# Altium schematic sheet Kinen Expansion.SchDoc
size B
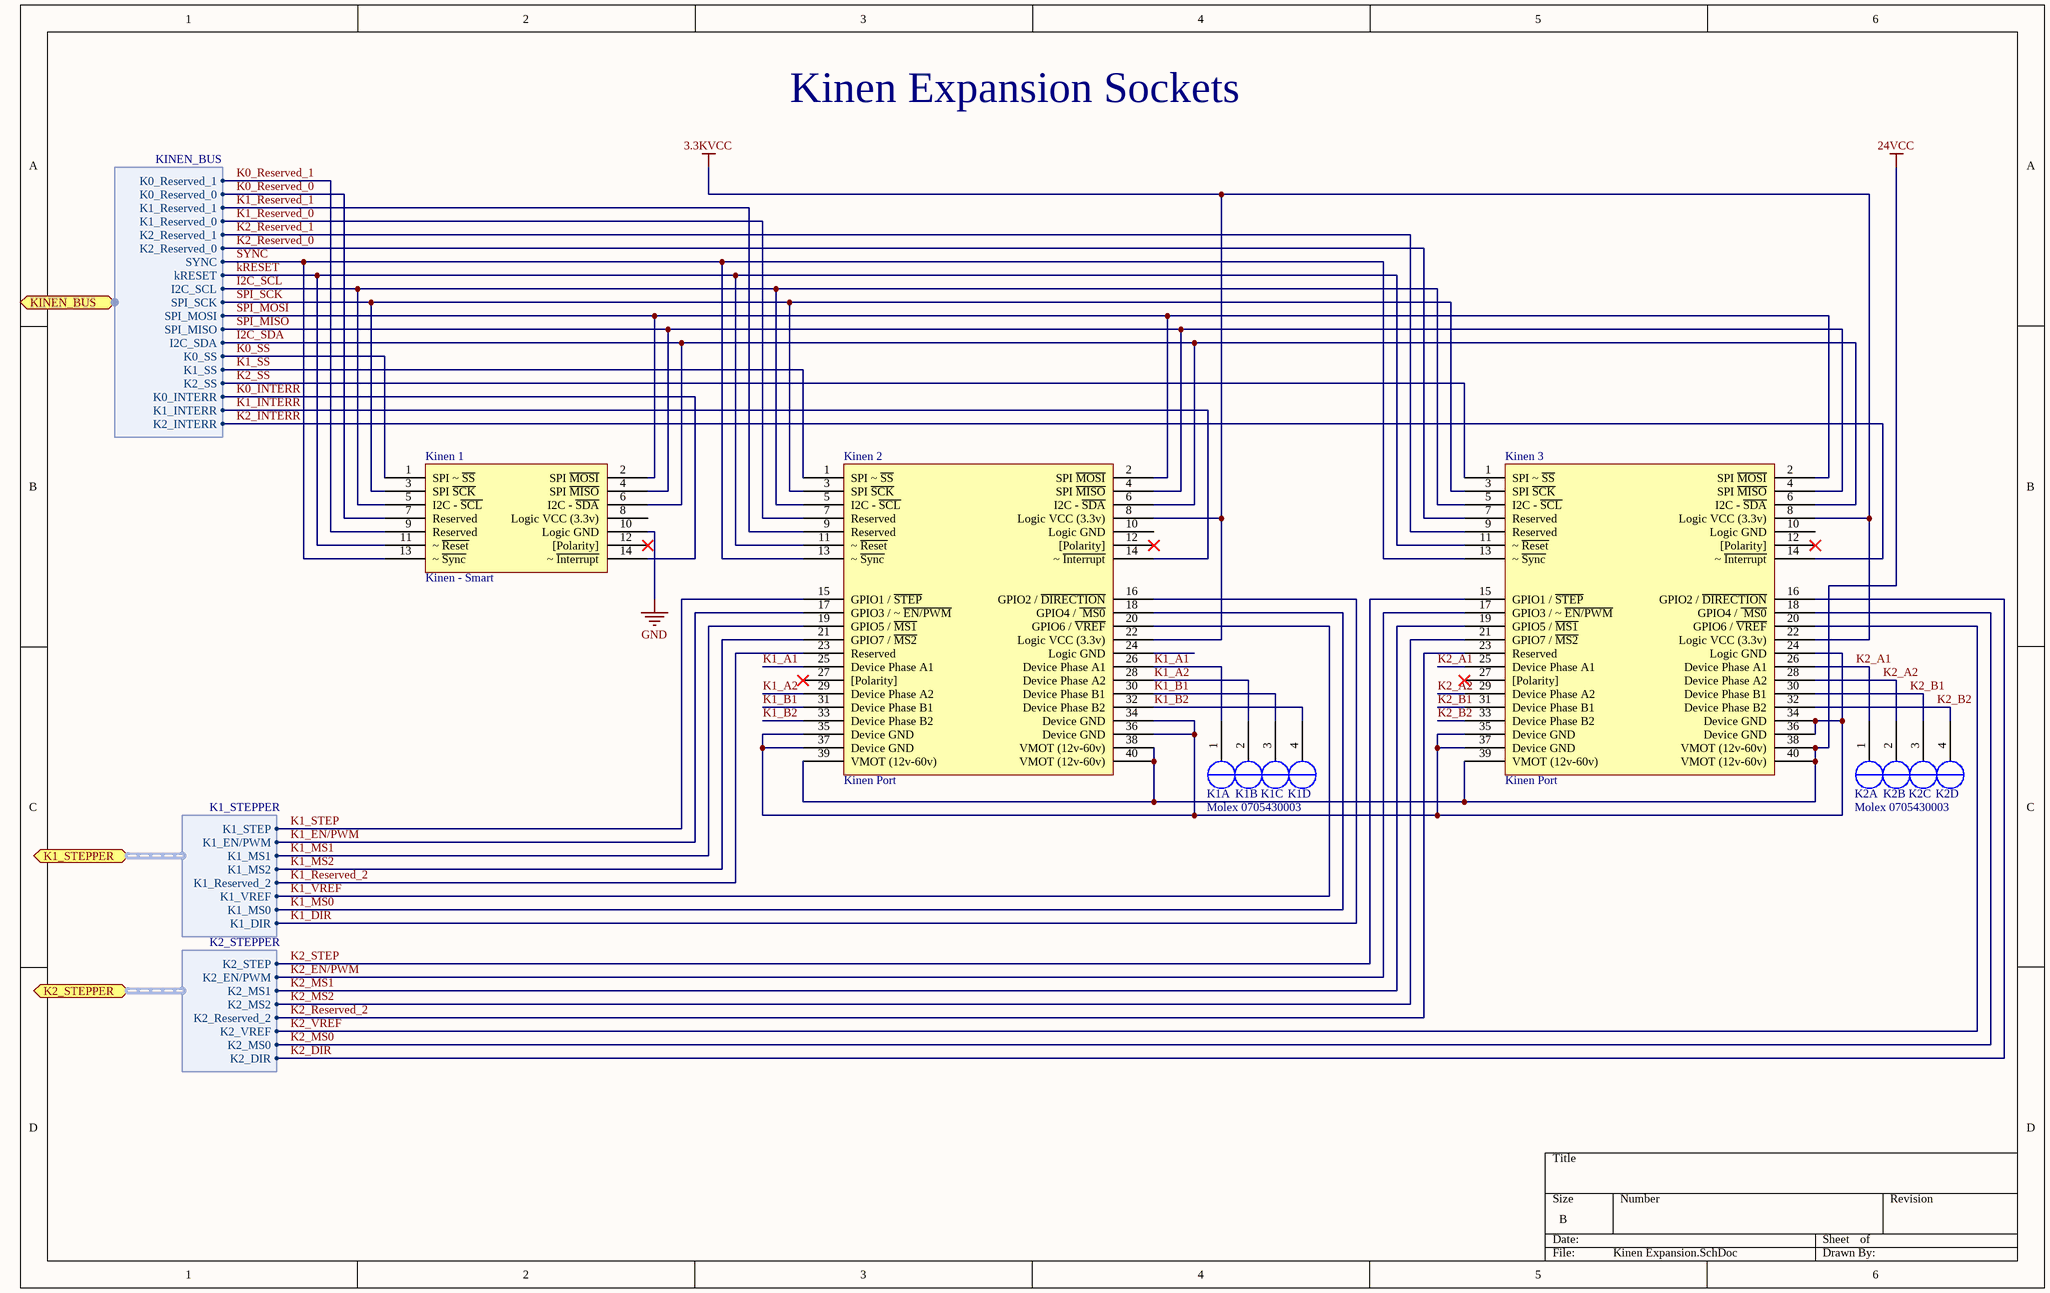
[diagram p0: Kinen Expansion.SchDoc]

## Parts
K1  Molex 0705430003  [Molex 0705430003]  (parts A,B,C,D of 4)
K2  Molex 0705430003  [Molex 0705430003]  (parts A,B,C,D of 4)
Kinen_1  Kinen - Smart  [Kinen Port - Smart - MOBO]
Kinen_2  Kinen Port  [Kinen Port - MOBO]
Kinen_3  Kinen Port  [Kinen Port - MOBO]

## Ports
K1_STEPPER (harness K1_STEPPER), K2_STEPPER (harness K2_STEPPER), KINEN_BUS (harness KINEN_BUS)

## Harnesses
K1_STEPPER: K1_STEP, K1_EN/PWM, K1_MS1, K1_MS2, K1_Reserved_2, K1_VREF, K1_MS0, K1_DIR
K2_STEPPER: K2_STEP, K2_EN/PWM, K2_MS1, K2_MS2, K2_Reserved_2, K2_VREF, K2_MS0, K2_DIR
KINEN_BUS: K0_Reserved_1, K0_Reserved_0, K1_Reserved_1, K1_Reserved_0, K2_Reserved_0, K2_Reserved_1, SYNC, kRESET, I2C_SCL, SPI_SCK, SPI_MOSI, SPI_MISO, I2C_SDA, K0_SS, K2_SS, K1_SS, K0_INTERR, K1_INTERR, K2_INTERR

## Nets
3.3KVCC: Kinen_2.8(Logic_VCC_(3.3v)) Kinen_2.22(Logic_VCC_(3.3v)) Kinen_3.8(Logic_VCC_(3.3v)) Kinen_3.22(Logic_VCC_(3.3v))
24VCC: Kinen_2.38(VMOT_(12v-60v)) Kinen_2.39(VMOT_(12v-60v)) Kinen_2.40(VMOT_(12v-60v)) Kinen_3.38(VMOT_(12v-60v)) Kinen_3.39(VMOT_(12v-60v)) Kinen_3.40(VMOT_(12v-60v))
GND: Kinen_1.10(Logic_GND)
I2C_SCL: Kinen_1.5(I2C_-_~{SCL}) Kinen_2.5(I2C_-_~{SCL}) Kinen_3.5(I2C_-_~{SCL}) ; port KINEN_BUS.I2C_SCL
I2C_SDA: Kinen_1.6(I2C_-_~{SDA}) Kinen_2.6(I2C_-_~{SDA}) Kinen_3.6(I2C_-_~{SDA}) ; port KINEN_BUS.I2C_SDA
K0_INTERR: Kinen_1.14(~_~{Interrupt}) ; port KINEN_BUS.K0_INTERR
K0_Reserved_0: Kinen_1.7(Reserved) ; port KINEN_BUS.K0_Reserved_0
K0_Reserved_1: Kinen_1.9(Reserved) ; port KINEN_BUS.K0_Reserved_1
K0_SS: Kinen_1.1(SPI_~_~{SS}) ; port KINEN_BUS.K0_SS
K1_A1: K1.1(OUT2B) Kinen_2.25(Device_Phase_A1) Kinen_2.26(Device_Phase_A1)
K1_A2: K1.2(OUT2A) Kinen_2.28(Device_Phase_A2) Kinen_2.29(Device_Phase_A2)
K1_B1: K1.3(OUT1A) Kinen_2.30(Device_Phase_B1) Kinen_2.31(Device_Phase_B1)
K1_B2: K1.4(OUT1B) Kinen_2.32(Device_Phase_B2) Kinen_2.33(Device_Phase_B2)
K1_DIR: Kinen_2.16(GPIO2_/_~{DIRECTION}) ; port K1_STEPPER.K1_DIR
K1_EN/PWM: Kinen_2.17(GPIO3_/_~_~{EN/PWM}) ; port K1_STEPPER.K1_EN/PWM
K1_INTERR: Kinen_2.14(~_~{Interrupt}) ; port KINEN_BUS.K1_INTERR
K1_MS0: Kinen_2.18(GPIO4_/_~{_MS0}) ; port K1_STEPPER.K1_MS0
K1_MS1: Kinen_2.19(GPIO5_/_~{MS1}) ; port K1_STEPPER.K1_MS1
K1_MS2: Kinen_2.21(GPIO7_/_~{MS2}) ; port K1_STEPPER.K1_MS2
K1_Reserved_0: Kinen_2.7(Reserved) ; port KINEN_BUS.K1_Reserved_0
K1_Reserved_1: Kinen_2.9(Reserved) ; port KINEN_BUS.K1_Reserved_1
K1_Reserved_2: Kinen_2.23(Reserved) ; port K1_STEPPER.K1_Reserved_2
K1_SS: Kinen_2.1(SPI_~_~{SS}) ; port KINEN_BUS.K1_SS
K1_STEP: Kinen_2.15(GPIO1_/_~{STEP}) ; port K1_STEPPER.K1_STEP
K1_VREF: Kinen_2.20(GPIO6_/_~{VREF}) ; port K1_STEPPER.K1_VREF
K2_A1: K2.1(OUT2B) Kinen_3.25(Device_Phase_A1) Kinen_3.26(Device_Phase_A1)
K2_A2: K2.2(OUT2A) Kinen_3.28(Device_Phase_A2) Kinen_3.29(Device_Phase_A2)
K2_B1: K2.3(OUT1A) Kinen_3.30(Device_Phase_B1) Kinen_3.31(Device_Phase_B1)
K2_B2: K2.4(OUT1B) Kinen_3.32(Device_Phase_B2) Kinen_3.33(Device_Phase_B2)
K2_DIR: Kinen_3.16(GPIO2_/_~{DIRECTION}) ; port K2_STEPPER.K2_DIR
K2_EN/PWM: Kinen_3.17(GPIO3_/_~_~{EN/PWM}) ; port K2_STEPPER.K2_EN/PWM
K2_INTERR: Kinen_3.14(~_~{Interrupt}) ; port KINEN_BUS.K2_INTERR
K2_MS0: Kinen_3.18(GPIO4_/_~{_MS0}) ; port K2_STEPPER.K2_MS0
K2_MS1: Kinen_3.19(GPIO5_/_~{MS1}) ; port K2_STEPPER.K2_MS1
K2_MS2: Kinen_3.21(GPIO7_/_~{MS2}) ; port K2_STEPPER.K2_MS2
K2_Reserved_0: Kinen_3.7(Reserved) ; port KINEN_BUS.K2_Reserved_0
K2_Reserved_1: Kinen_3.9(Reserved) ; port KINEN_BUS.K2_Reserved_1
K2_Reserved_2: Kinen_3.23(Reserved) ; port K2_STEPPER.K2_Reserved_2
K2_SS: Kinen_3.1(SPI_~_~{SS}) ; port KINEN_BUS.K2_SS
K2_STEP: Kinen_3.15(GPIO1_/_~{STEP}) ; port K2_STEPPER.K2_STEP
K2_VREF: Kinen_3.20(GPIO6_/_~{VREF}) ; port K2_STEPPER.K2_VREF
kRESET: Kinen_1.11(~_~{Reset}) Kinen_2.11(~_~{Reset}) Kinen_3.11(~_~{Reset}) ; port KINEN_BUS.kRESET
SPI_MISO: Kinen_1.4(SPI_~{MISO}) Kinen_2.4(SPI_~{MISO}) Kinen_3.4(SPI_~{MISO}) ; port KINEN_BUS.SPI_MISO
SPI_MOSI: Kinen_1.2(SPI_~{MOSI}) Kinen_2.2(SPI_~{MOSI}) Kinen_3.2(SPI_~{MOSI}) ; port KINEN_BUS.SPI_MOSI
SPI_SCK: Kinen_1.3(SPI_~{SCK}) Kinen_2.3(SPI_~{SCK}) Kinen_3.3(SPI_~{SCK}) ; port KINEN_BUS.SPI_SCK
SYNC: Kinen_1.13(~_~{Sync}) Kinen_2.13(~_~{Sync}) Kinen_3.13(~_~{Sync}) ; port KINEN_BUS.SYNC
NetKinen_2_34: Kinen_2.34(Device_GND) Kinen_2.35(Device_GND) Kinen_2.36(Device_GND) Kinen_2.37(Device_GND) Kinen_3.24(Logic_GND) Kinen_3.34(Device_GND) Kinen_3.35(Device_GND) Kinen_3.36(Device_GND) Kinen_3.37(Device_GND)

Not connected (* = marked no-connect by the designer): Kinen_1 8(Logic_VCC_(3.3v)) 12([Polarity])*; Kinen_2 10(Logic_GND) 12([Polarity])* 24(Logic_GND) 27([Polarity])*; Kinen_3 10(Logic_GND) 12([Polarity])* 27([Polarity])*

## Notes on the sheet
- Kinen Expansion Sockets

## Library data of the parts
K1 K2 = Molex 0705430003 Alt: Molex 4 Pin Clip Connector
Kinen_2 Kinen_3 = Kinen Device NEW